# EasyEDA schematic geniecom_sch.json
TITLE: Adaptador NES - Phantom; REV: 1.0; Date: 2025-06-09; Sheet: 1/1; Drawn By: robertofelix; Company: AidentuNet
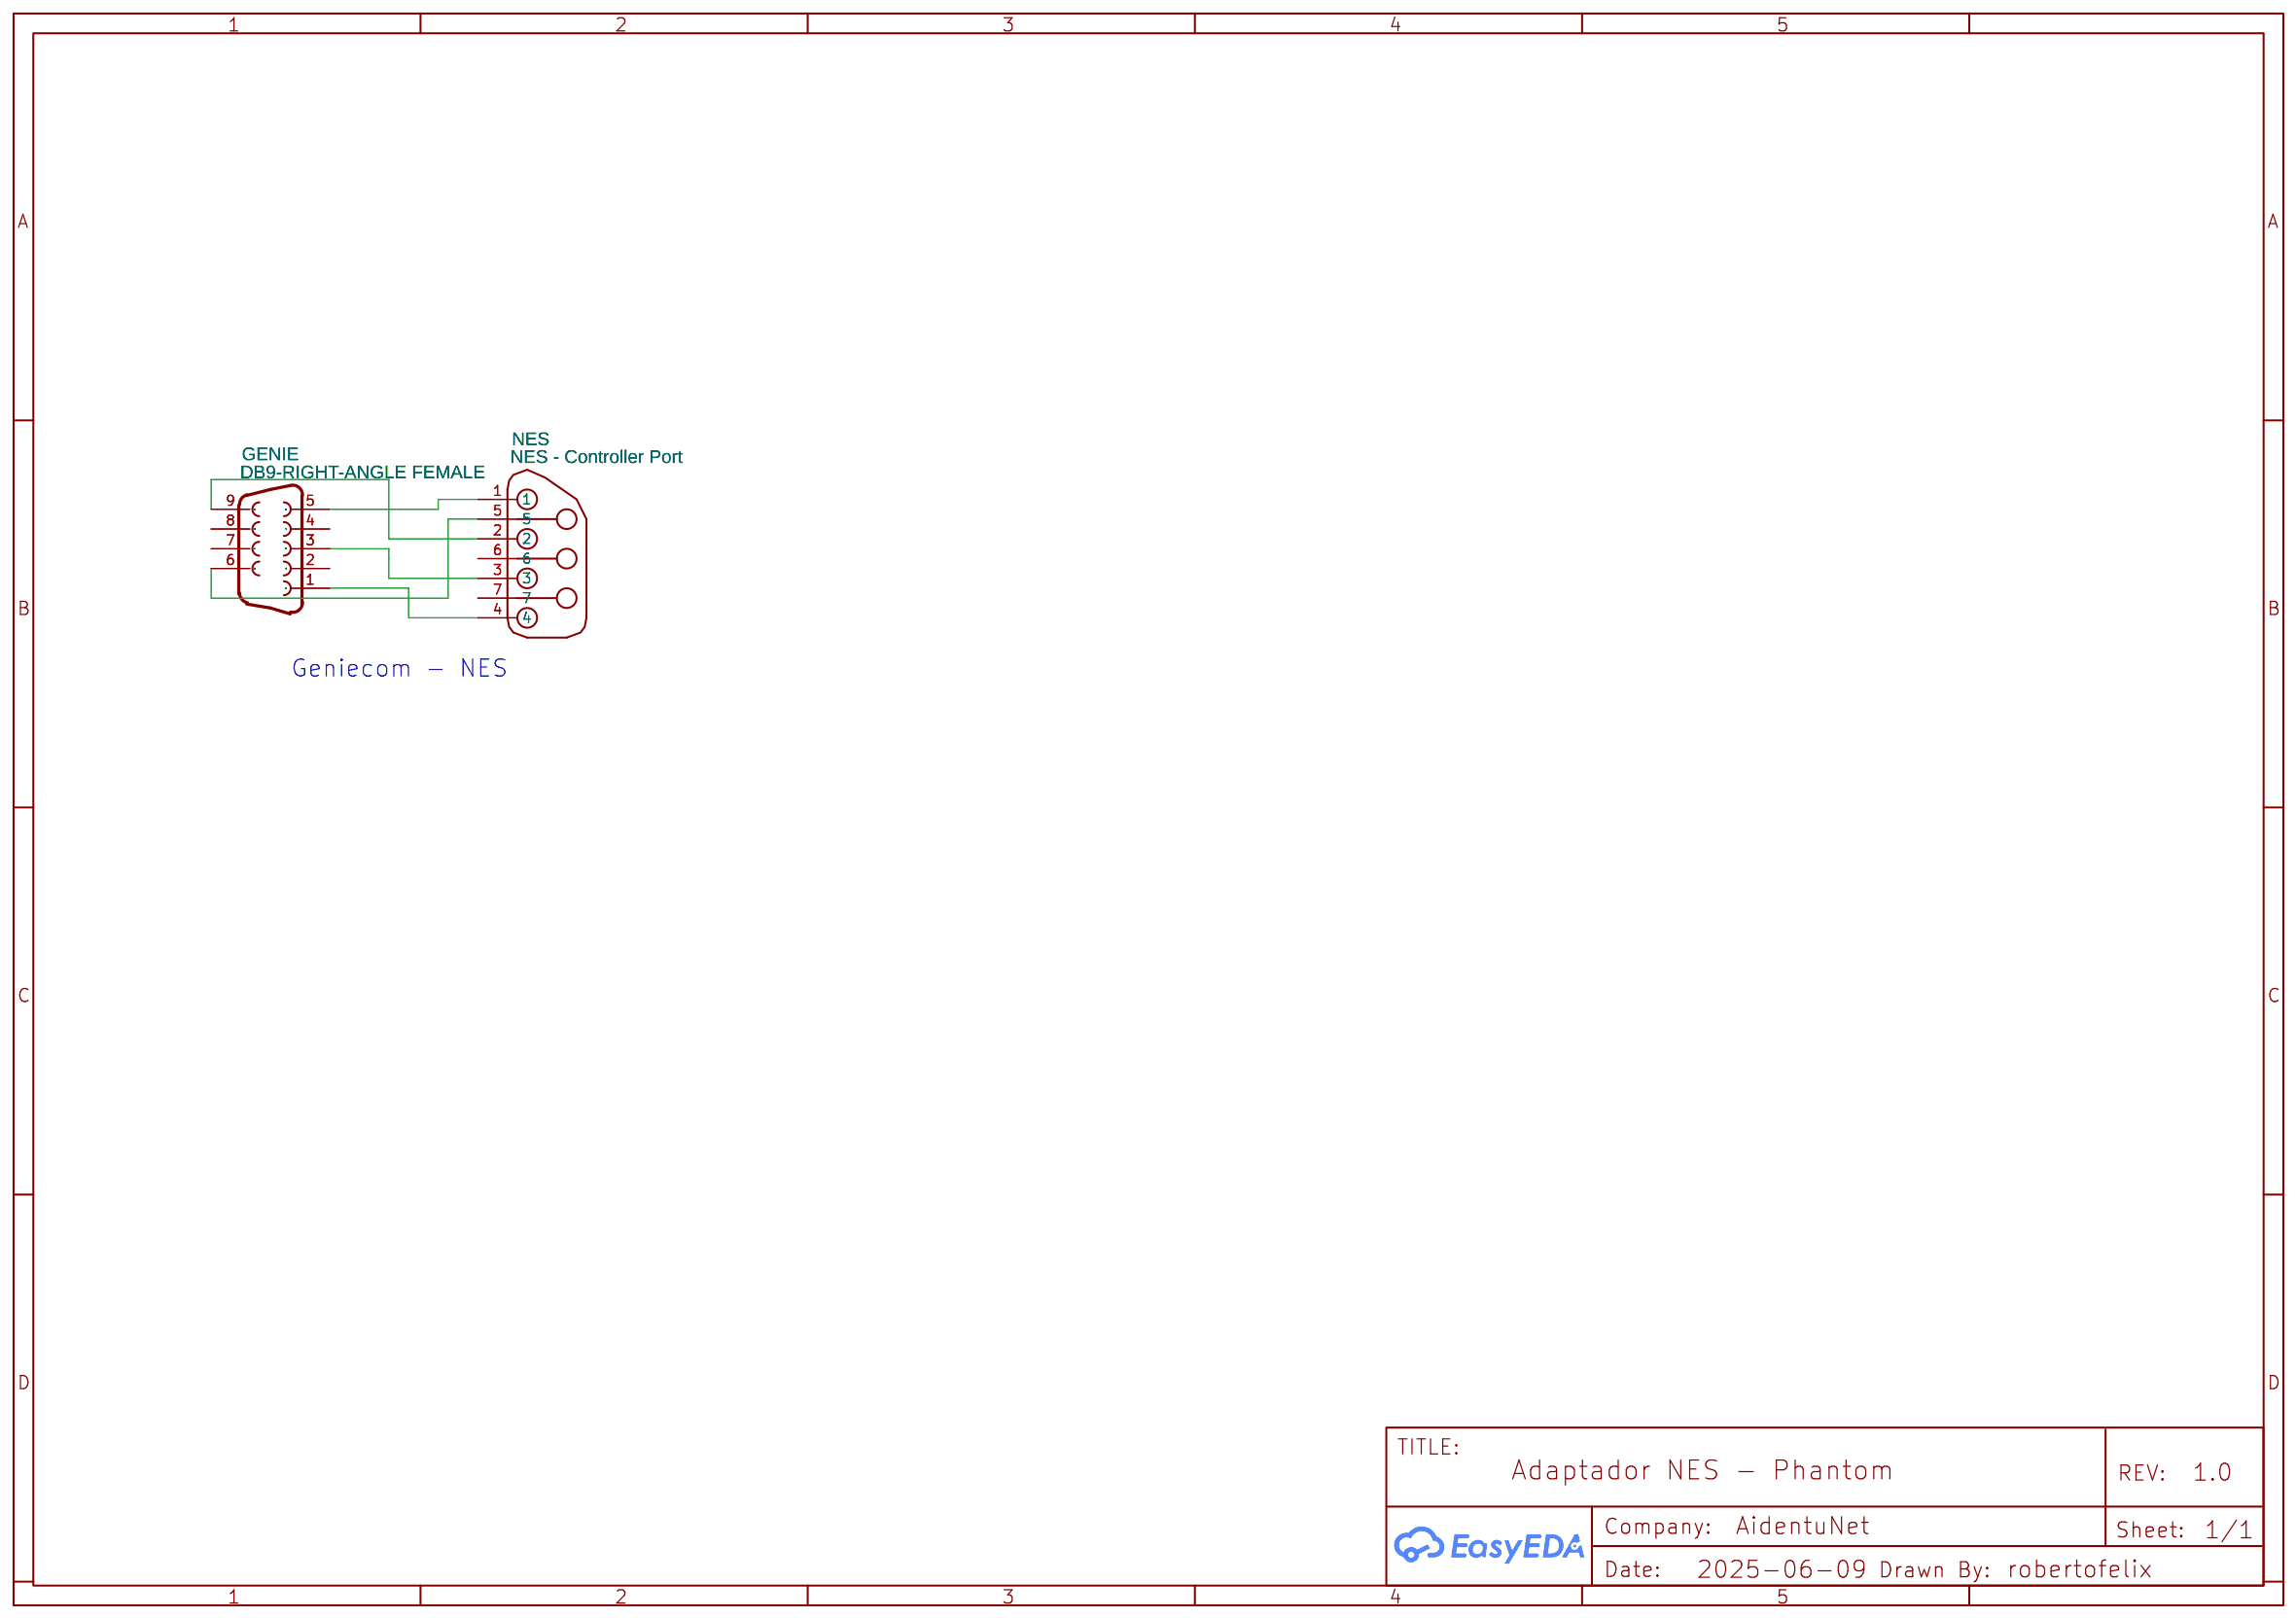
[diagram p0: schematic sheet]

## Parts
GENIE  DB9-RIGHT-ANGLE FEMALE  [DB9-RIGHT-ANGLE FEMALE]
NES  NES - Controller Port  [NES CONTROLLER 7 PIN FEMALE CONNECTOR WITH MOUNT PEGS]

## Library data of the parts
GENIE = DB9-RIGHT-ANGLE FEMALE: Contributor: hernandos; Package Display: No
NES = NES - Controller Port: Supplier Part: CONN-NES-V; link: https://www.raphnet-tech.com/products/nes_controller_connector/index.php; Contributor: vejymonsta; Package Display: No

## Nets
Net-(GENIE-1): GENIE.1 NES.4
Net-(GENIE-3): GENIE.3 NES.3
Net-(GENIE-5): GENIE.5 NES.1
Net-(GENIE-6): GENIE.6 NES.5
Net-(GENIE-9): GENIE.9 NES.2

Not connected (* = marked no-connect by the designer): GENIE 2 4 7 8; NES 6 7

## Notes on the sheet
- Geniecom - NES
